# Altium project JWB-001_Main.PrjPcb
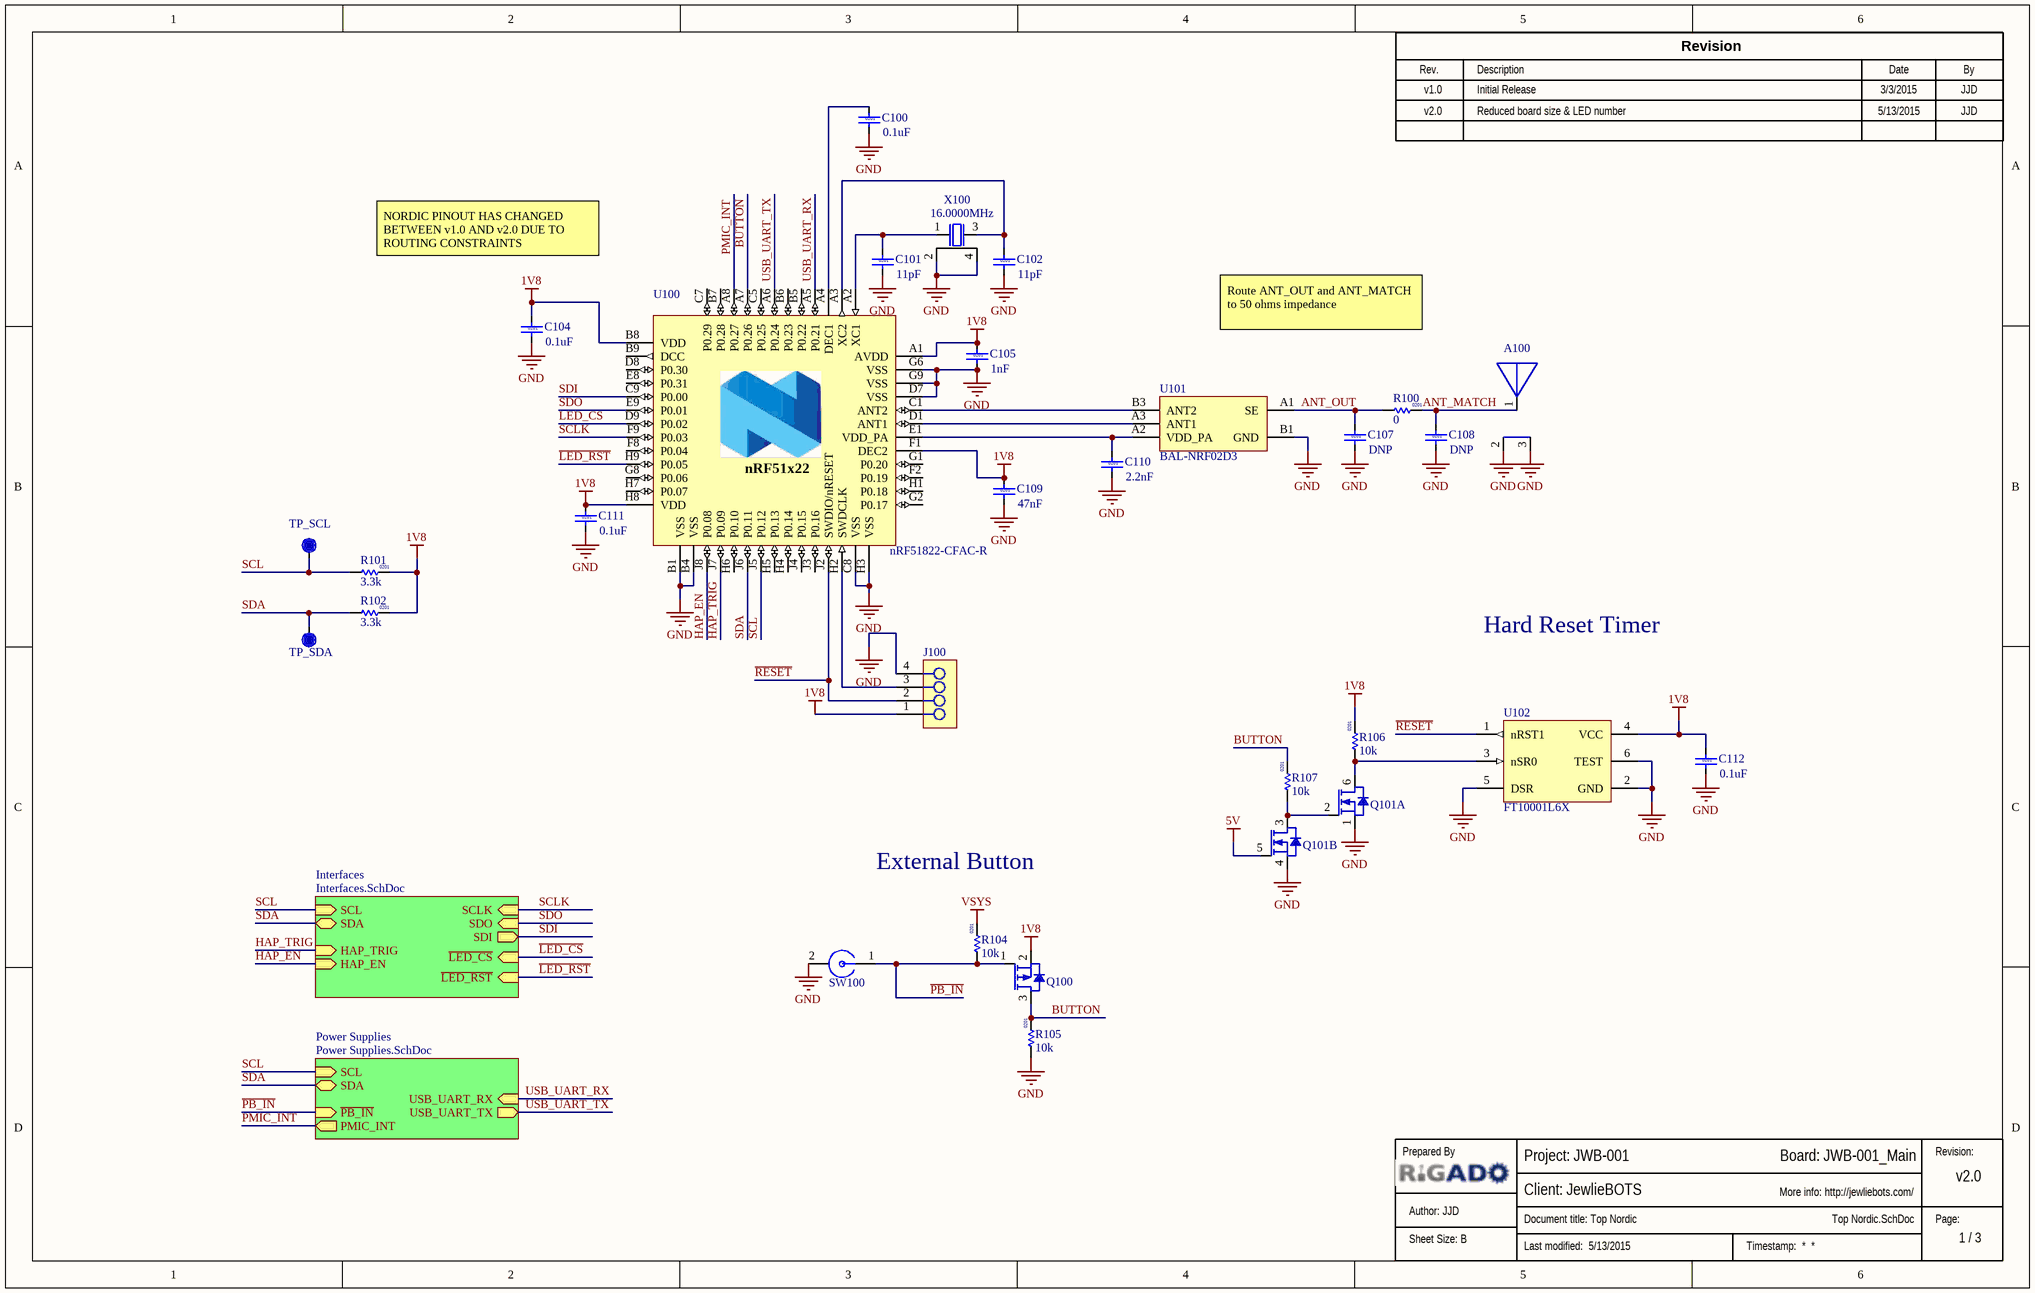
[diagram p0: Top Nordic.SchDoc]
SchSheetTotal: 3; ReleaseRev2: v2.0; ReleaseRev1: v1.0; ReleaseDesc2: Reduced board size & LED number; ReleaseDesc1: Initial Release; ReleaseDate2: 5/13/2015; ReleaseDate1: 3/3/2015; ReleaseBy2: JJD; ReleaseBy1: JJD; ProjectEngineer: JJD; PCBName: JWB-001_Main; GlobalReleaseDate: 5/13/2015; GlobalProjectTeam: Rigado, LLC.; GlobalProjectRevision: v2.0; GlobalProjectName: JWB-001; GlobalProjectLink: http://jewliebots.com/; GlobalClientName: JewlieBOTS
3 sheets, 87 parts. Net scope: hierarchical (ports join the sheet entries above them; power ports are global).
Board file: JWB-001_Main.PcbDoc
Sheets:
  Top Nordic.SchDoc
    Interfaces = Interfaces.SchDoc
    Power Supplies = Power Supplies.SchDoc

## Sheet Top Nordic.SchDoc: Top Nordic
size B; CompanyName: Rigado, LLC; SheetNumber: 1; Website: www.rigado.com; SheetSize: B

### Parts
(Parts that share a designator on the sheet are numbered #1, #2 ... from top to bottom, then left to right.)
?#1  (no value)  (graphical)
?#2  (no value)  (graphical)
A100  2450AT07A0100  [2450AT07A0100]  (value not drawn)
C100  value 0.1uF  Size: 0201  [Cap 0201 HD]  (hidden comment: Cap 0201 0.1uF 6.3V0.1uF)
C101  value 11pF  Size: 0201  [Cap 0201 HD]  (hidden comment: Cap 0201 11pF 25V11pF)
C102  value 11pF  Size: 0201  [Cap 0201 HD]  (hidden comment: Cap 0201 11pF 25V11pF)
C104  value 0.1uF  Size: 0201  [Cap 0201 HD]  (hidden comment: Cap 0201 0.1uF 6.3V0.1uF)
C105  value 1nF  Size: 0201  [Cap 0201 HD]  (hidden comment: Cap 0201 1nF 25V1nF)
C107  value DNP  Size: 0201  [Cap 0201 HD]  (hidden comment: Cap 0201 GenericDNPDNP)
C108  value DNP  Size: 0201  [Cap 0201 HD]  (hidden comment: Cap 0201 GenericDNPDNP)
C109  value 47nF  Size: 0201  [Cap 0201 HD]  (hidden comment: Cap 0201 47nF 10V47nF)
C110  value 2.2nF  Size: 0201  [Cap 0201 HD]  (hidden comment: Cap 0201 2.2nF 16V2.2nF)
C111  value 0.1uF  Size: 0201  [Cap 0201 HD]  (hidden comment: Cap 0201 0.1uF 6.3V0.1uF)
C112  value 0.1uF  Size: 0201  [Cap 0201 HD]  (hidden comment: Cap 0201 0.1uF 6.3V0.1uF)
J100  SWD_Pogo_TPDNP  [TP10R_1.27P-4Pin]  (value not drawn)
Q100  RZM001P02  [SOT-723]  (value not drawn)
Q101  Si1902CDL  [SC70-6]  (value not drawn)  (parts A,B of 2)
R100  value 0  Size: 0201  [RES 0201 HD]  (hidden comment: Res 0201 0R Jumper0)
R101  value 3.3k  Size: 0201  [RES 0201 HD]  (hidden comment: Res 0201 3.3k 5%3.3k)
R102  value 3.3k  Size: 0201  [RES 0201 HD]  (hidden comment: Res 0201 3.3k 5%3.3k)
R104  value 10k  Size: 0201  [RES 0201 HD]  (hidden comment: Res 0201 10k 5%10k)
R105  value 10k  Size: 0201  [RES 0201 HD]  (hidden comment: Res 0201 10k 5%10k)
R106  value 10k  Size: 0201  [RES 0201 HD]  (hidden comment: Res 0201 10k 5%10k)
R107  value 10k  Size: 0201  [RES 0201 HD]  (hidden comment: Res 0201 10k 5%10k)
SW100  GX05170  [GX05170]  (value not drawn)
TP_SCL  TP  [TP10R]  (value not drawn)
TP_SDA  TP  [TP10R]  (value not drawn)
U100  Manufacturer P/N: nRF51822-CFAC-R  [CFAC_WLCSP]
U101  BAL-NRF02D3  [BGA0.4P2x3-5Pin]
U102  FT10001L6X  [DFN0.5P-6Pin]
X100  Frequency: 16.0000MHz  [XTAL_2016]

### Sub-sheets
Interfaces = Interfaces.SchDoc: SDA (bidir), SCL (in), SDO (in), ~{LED_CS} (in), ~{LED_RST} (in), SCLK (in), HAP_EN (in), HAP_TRIG (in), SDI (out)
Power Supplies = Power Supplies.SchDoc: SCL (in), SDA (bidir), PMIC_INT (out), ~{PB_IN} (in), USB_UART_RX (in), USB_UART_TX (out)

### Nets
1V8: C104.1 C105.1 C109.1 C111.1 C112.1 J100.1 Q100.2(S) R101.2 R102.2 R106.2 U100.A1(AVDD) U100.B8(VDD) U100.F1(DEC2) U100.H8(VDD) U102.4(VCC)
5V: Q101.5(G2)
GND: A100.2 A100.3 C100.2 C101.2 C102.2 C104.2 C105.2 C107.2 C108.2 C109.2 C110.2 C111.2 C112.2 J100.4 Q101.1(S1) Q101.4(S2) R105.1 SW100.2 U100.B1(VSS) U100.B4(VSS) U100.C8(VSS) U100.D7(VSS) U100.G3(N.C.) U100.G4(N.C.) U100.G6(VSS) U100.G9(VSS) U100.H3(VSS) U101.B1(GND) U102.2(GND) U102.5(DSR) U102.6(TEST) X100.2 X100.4
VSYS: R104.2
~{LED_CS}: U100.D9(P0.02) ; sheet Interfaces/~{LED_CS}
~{LED_RST}: U100.H9(P0.05) ; sheet Interfaces/~{LED_RST}
~{PB_IN}: Q100.1(G) R104.1 SW100.1 ; sheet Power Supplies/~{PB_IN}
~{RESET}: J100.2 U100.J2(SWDIO/nRESET) U102.1(nRST1)
ANT_MATCH: A100.1 C108.1 R100.2
ANT_OUT: C107.1 R100.1 U101.A1(SE)
BUTTON: Q100.3(D) R105.2 R107.2 U100.A7(P0.26)
HAP_EN: U100.J8(P0.08) ; sheet Interfaces/HAP_EN
HAP_TRIG: U100.J7(P0.09) ; sheet Interfaces/HAP_TRIG
PMIC_INT: U100.A8(P0.27) ; sheet Power Supplies/PMIC_INT
SCL: R101.1 TP_SCL.1 U100.J5(P0.12) ; sheet Interfaces/SCL, sheet Power Supplies/SCL
SCLK: U100.F9(P0.03) ; sheet Interfaces/SCLK
SDA: R102.1 TP_SDA.1 U100.J6(P0.11) ; sheet Interfaces/SDA, sheet Power Supplies/SDA
SDI: U100.C9(P0.00) ; sheet Interfaces/SDI
SDO: U100.E9(P0.01) ; sheet Interfaces/SDO
USB_UART_RX: U100.A5(P0.21) ; sheet Power Supplies/USB_UART_RX
USB_UART_TX: U100.A6(P0.24) ; sheet Power Supplies/USB_UART_TX
NetC100_1: C100.1 U100.A4(DEC1)
NetC101_1: C101.1 U100.A2(XC1) X100.1
NetC102_1: C102.1 U100.A3(XC2) X100.3
NetC110_1: C110.1 U100.E1(VDD_PA) U101.A2(VDD_PA)
NetJ100_3: J100.3 U100.H2(SWDCLK)
NetQ101_2: Q101.2(G1) Q101.3(D2) R107.1
NetQ101_6: Q101.6(D1) R106.1 U102.3(nSR0)
NetU100_C1: U100.C1(ANT2) U101.B3(ANT2)
NetU100_D1: U100.D1(ANT1) U101.A3(ANT1)

Not connected (* = marked no-connect by the designer): U100 B5(P0.22) B6(P0.23) B7(P0.28) B9(DCC) C5(P0.25) C6(N.C.) C7(P0.29) D8(P0.30) E2(N.C.) E3(N.C.) E7(N.C.) E8(P0.31) F2(P0.19) F3(N.C.) F7(N.C.) F8(P0.04) G1(P0.20) G2(P0.17) G5(N.C.) G7(N.C.) G8(P0.06) H1(P0.18) H4(P0.14) H5(P0.13) H6(P0.10) H7(P0.07) J3(P0.16) J4(P0.15)

### Notes on the sheet
- NORDIC PINOUT HAS CHANGED BETWEEN v1.0 AND v2.0 DUE TO ROUTING CONSTRAINTS
- Route ANT_OUT and ANT_MATCH to 50 ohms impedance
- Hard Reset Timer
- External Button
- Rev.
- Description
- Revision
- Date
- By
- Prepared By
- Revision:
- Page:
- (in symbol nRF51822-CFAC) nRF51x22

### Library data of the parts
?#1 = Top_Revision_Block: Release Revision History Block
?#2 = Top_Title_Block: Top level schematic title block for top level sheet
A100 = 2450AT07A0100: Utra-Minature 2.4GHz Chip antenna, 1.0mm x 0.5mm; Manufacturer: Johanson Technology; Vendor: Digikey; Vendor P/N: 712-1572-1-ND; Added By: Jeremy D; Part Number: 2450AT07A0100; Manufacturer P/N: 2450AT07A0100; Size: 1mmx0.5mm; Height: 0.37mm; Internal Antenna: N/A; RF Freq: 2.4GHz; Added Date: 1/31/2015; Checked Date: 2/5/2015; Checked By: Paul B
C100 C104 C111 C112 = Cap 0201 0.1uF 6.3V: Cap, Ceramic 0.1uF 6.3V 10% X5R  0201; Manufacturer P/N: GRM033R60J104KE19D; Manufacturer: Murata; Manufacturer 2 P/N: C0603X5R0J104K030BC; Vendor: Digikey; Vendor P/N: 490-3167-1-ND; Added By: Jeremy D; Part Number: Cap 0201 0.1uF 6.3V; Tolerance: 10%; Voltage: 6.3V; Manufacturer 2: TDK; Height: 0.33mm; Temp Coefficient: X5R; Added Date: 2/1/2015; Checked By: Cam N; Checked Date: 2/27/2015
C101 C102 = Cap 0201 11pF 25V: Cap, Ceramic 11pF 25V 5% NPO  0201; Manufacturer P/N: CL03C110JA3GNNC; Manufacturer: Samsung; Manufacturer 2 P/N: C0603C0G1E110J030BG; Vendor: Digikey; Vendor P/N: 1276-1386-1-ND; Added By: Jeremy D; Part Number: Cap 0201 11pF 25V; Tolerance: 5%; Voltage: 25V; Manufacturer 2: TDK; Temp Coefficient: NPO; Height: 0.33mm; Added Date: 2/24/2015; Checked By: Cam N; Checked Date: 2/27/2015
C105 = Cap 0201 1nF 25V: Cap, Ceramic 1nF 25V 10% X7R  0201; Manufacturer P/N: GRM033R71E102KA01D; Manufacturer: Murata; Manufacturer 2 P/N: C0603X7R1E102K030BA; Vendor: Digikey; Vendor P/N: 490-3184-1-ND; Added By: Jeremy D; Part Number: Cap 0201 1nF 25V; Tolerance: 10%; Voltage: 25V; Manufacturer 2: TDK; Temp Coefficient: X7R; Height: 0.33mm; Added Date: 2/24/2015; Checked By: Cam N; Checked Date: 2/27/2015
C107 C108 = Cap 0201 Generic: Capacitor, Ceramic 0201; Added By: Jeremy D; Part Number: Cap 0201 Generic; Height: 0.33mm; DNP: DNP; Added Date: 2/1/2015; Checked By: Paul B; Checked Date: 2/5/2015
C109 = Cap 0201 47nF 10V: Cap, Ceramic 47nF 10V 10% X5R  0201; Manufacturer P/N: LMK063BJ473KP-F; Manufacturer: Taiyo Yuden; Manufacturer 2 P/N: CL03A473KP3NNNC; Vendor: Digikey; Vendor P/N: 587-2242-1-ND; Added By: Jeremy D; Part Number: Cap 0201 47nF 10V; Tolerance: 10%; Voltage: 10V; Manufacturer 2: Samsung; Temp Coefficient: X5R; Height: 0.33mm; Added Date: 2/24/2015; Checked By: Cam N; Checked Date: 2/27/2015
C110 = Cap 0201 2.2nF 16V: Cap, Ceramic 2.2nF 16V 10% X7R  0201; Manufacturer P/N: GRM033R71C222KA88D; Manufacturer: Murata; Manufacturer 2 P/N: C0603X7R1C222K030BA; Vendor: Digikey; Vendor P/N: 490-3190-1-ND; Added By: Jeremy D; Part Number: Cap 0201 2.2nF 16V; Tolerance: 10%; Voltage: 16V; Manufacturer 2: TDK; Temp Coefficient: X7R; Height: 0.33mm; Added Date: 2/24/2015; Checked By: Cam N; Checked Date: 2/27/2015
J100 = SWD_Pogo_TP: Test points for 4-wire Serial Wire Debugger header Pogo Pin harness; Added By: Jeremy D; Part Number: SWD_Pogo_TP; Size: 4.8mm x 1mm; Height: 0; DNP: DNP; Added Date: 2/23/2015; Checked By: Cam N; Checked Date: 2/27/2015
Q100 = RZM001P02: P-MOSFET, 20V 100mA, SOT-723; Manufacturer P/N: RZM001P02T2L; Manufacturer: Rohm; VGS Threshold: -1.0V; Vendor: Digikey; Vendor P/N: RZM001P02T2LCT-ND; Added By: Jeremy D; Part Number: RZM001P02; Size: 1.2mm x 0.8mm; Package: SOT-723; Height: 0.55mm; Voltage Rated: 20V; Idc: 100mA; Type: P-MOSFET; Added Date: 2/22/2015; Checked By: Cam N; Checked Date: 2/27/2015
Q101 = Si1902CDL: Dual N-MOSFET, 20V 1A, SC70-6; Manufacturer P/N: SI1902CDL-T1-GE3; Manufacturer: Vishay; VGS Threshold: 1.5V; Vendor: Mouser; Vendor P/N: 78-SI1902CDL-T1-GE3; Added By: Jeremy D; Part Number: Si1902CDL; Size: 2.4mm x 2.2mm; Package: SC70-6; Height: 1.1mm; Voltage Rated: 20V; Idc: 1A; Type: N-MOSFET; Added Date: 3/3/2015; Checked By: Cam N; Checked Date: 3/3/2015
R100 = Res 0201 0R Jumper: Resistor 0 ohm  1/20W, 0201; Manufacturer P/N: RC0603J000CS; Manufacturer: Samsung; Manufacturer 2 P/N: ERJ-1GN0R00C; Vendor: Digikey; Vendor P/N: 1276-3742-1-ND; Added By: Jeremy D; Part Number: Res 0201 0R Jumper; Manufacturer 2: Panasonic; Height: 0.26mm; Power: 1/20W; Added Date: 2/24/2015; Checked By: Cam N; Checked Date: 2/27/2015
R101 R102 = Res 0201 3.3k 5%: Resistor 3.3k ohm 5% 1/20W, 0201; Manufacturer P/N: RC0603J332CS; Manufacturer: Samsung; Manufacturer 2 P/N: MCR006YRTJ332; Vendor: Digikey; Vendor P/N: 1276-3806-1-ND; Added By: Jeremy D; Part Number: Res 0201 3.3k 5%; Manufacturer 2: Rohm; Tolerance: 5%; Height: 0.26mm; Power: 1/20W; Added Date: 2/24/2015; Checked By: Cam N; Checked Date: 2/27/2015
R104-R107 = Res 0201 10k 5%: Resistor 10k ohm 5% 1/20W 0201; Manufacturer P/N: MCR006YRTJ103; Manufacturer: Rohm; Manufacturer 2 P/N: ERJ-1GEJ103C; Vendor: Digikey; Vendor P/N: RHM10KCCCT-ND; Added By: Jeremy D; Part Number: Res 0201 10k 5%; Manufacturer 2: Panasonic; Tolerance: 5%; Height: 0.26mm; Power: 1/20W; Added Date: 2/1/2015; Checked By: Paul B; Checked Date: 2/5/2015
SW100 = GX05170: Snap Dome, high activation force, 5.3mm dia; Manufacturer: Snaptron; Num Positions: 1; Circuit Type: MOM; Added By: Jeremy D; Part Number: GX05170; Manufacturer P/N: GX05170; Size: 5.3mm dia; Height: 0.254mm; Vendor: Snaptron; Added Date: 2/18/2015; Checked By: Cam N; Checked Date: 2/27/2015
TP_SCL TP_SDA = TP10R: Testpoint, Round 1.0mm Dia; Added By: Jeremy D; Part Number: TP10R; Size: 1.0mm; Height: 0; Added Date: 2/1/2015; Checked By: Paul B; Checked Date: 2/5/2015; DNP: DNP
U100 = nRF51822-CFAC: Multiporotocol Bluetooth low energy/2.4GHz RF System on Chip; Manufacturer: Nordic Semiconductor; MFG Footprint: WLCSP 3.83mm x 3.83 mm; Pin #: 62; Voltage-Rated: 3.6V; Flash: 256kB; RAM: 32kB; Number of Bits: 32; Vendor: Digikey; Vendor P/N: 1490-1041-1-ND; Added By: Jeremy D; Part Number: nRF51822-CFAC; Height: .55mm; Packaging: Tape & Reel; Features: 2.4 GHz Transceiver, ARM Cortex M0 32 bit, ADC, 31 GPIO, Serial Protocols; Added Date: 1/30/2015; Checked By: Paul B; Checked Date: 2/5/2015
U101 = BAL-NRF02D3: Balun, 50 ohm transformer for nRF51x22; Manufacturer: ST Micro; RF Freq: 2.4GHz; Vendor: Digikey; Vendor P/N: 497-14009-1-ND; Added By: Jeremy D; Manufacturer P/N: BAL-NRF02D3; Part Number: BAL-NRF02D3; Size: 1.435mmx.905mm; Height: 0.69mm; Internal Antenna: N/A; Added Date: 1/30/2015; Checked Date: 2/5/2015; Checked By: Paul B
U102 = FT10001L6X: Reset Timer with 10.0sec Fixed Delay and Reset Pulse, 1.65v-5.0v; Manufacturer: Fairchild; MFG Footprint: 6-UFDFN; Controller Interface: Discrete; Added By: Jeremy D; Manufacturer P/N: FT10001L6X; Part Number: FT10001L6X; Height: .55mm; Size: 1.45mm x 1.0mm; Type: Reset Timer; Features: Fixed 10.0sec delay, 530ms Reset Pulse; Supplier 1: Digi-key; Supplier Part Number 1: FT10001L6XCT-ND; Added Date: 3/30/2015
X100 = FA-128 16.0000M: Crystal, 16.0000MHz, 10ppm, 2.0mm x 1.6mm; Manufacturer: EPSON; Manufacturer P/N: FA-128 16.0000MF10Z -ACX; Tolerance: +/- 10ppm; CL: 9pF; Temp Range: -20C to +75C; Vendor: Arrow; Added By: Jeremy D; Part Number: FA-128 16.0000M; Size: 2.0mm x 1.6mm; Height: 0.5mm; Added Date: 1/31/2015; Checked By: Paul B; Checked Date: 2/5/2015

## Sheet Interfaces.SchDoc
size B; CompanyName: Rigado, LLC; Organization: Rigado, LLC; SheetNumber: 2; SheetSize: B; SheetTitle: LED Driver
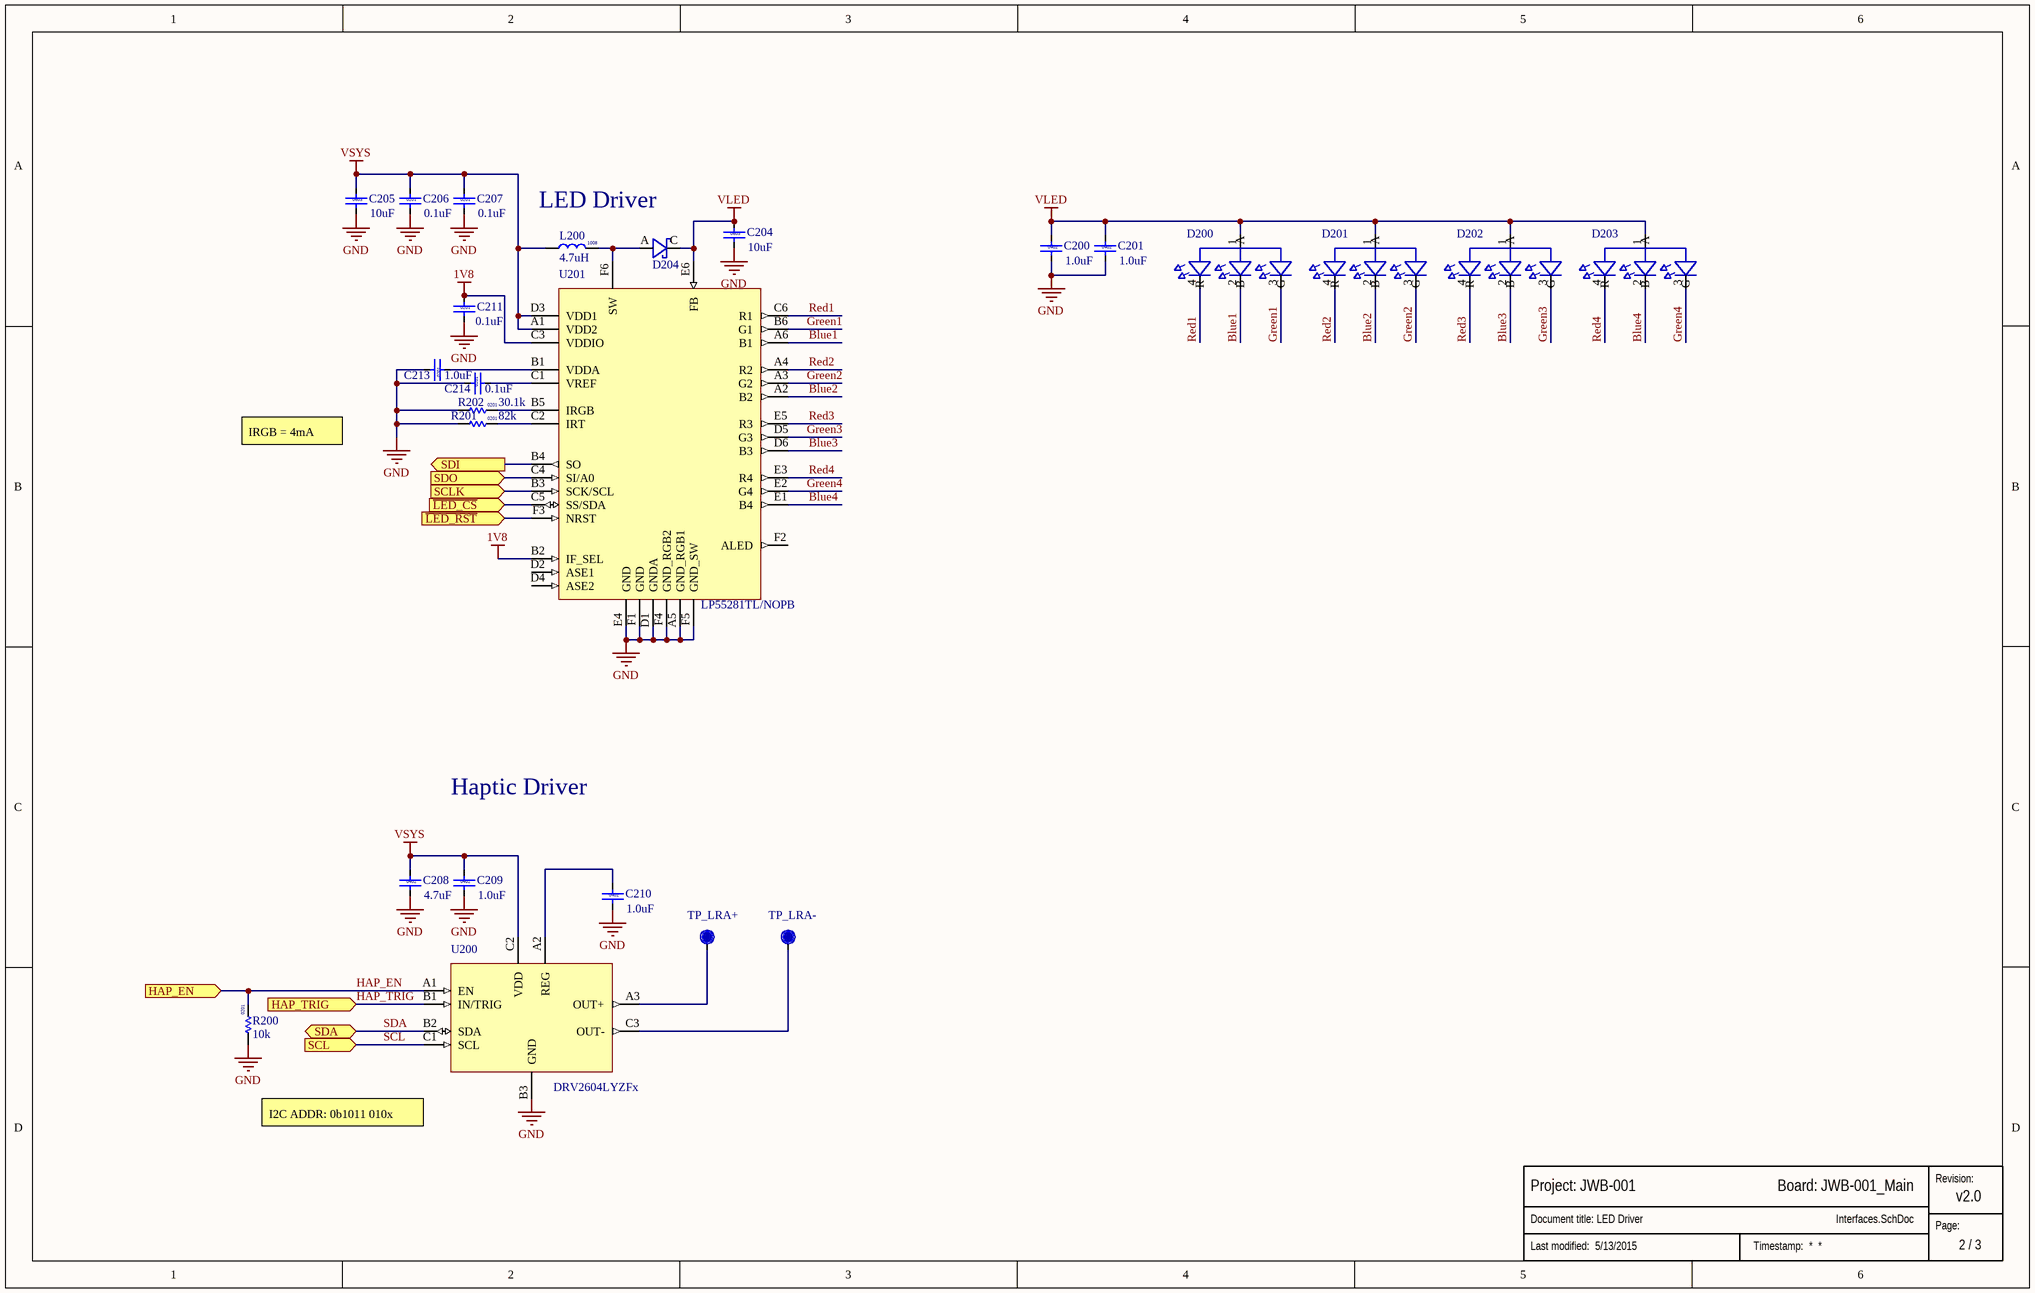
[diagram p1: Interfaces.SchDoc]

### Parts
(Parts that share a designator on the sheet are numbered #1, #2 ... from top to bottom, then left to right.)
?#3  (no value)  (graphical)
C200  value 1.0uF  Size: 0402  [Cap 0402 HD]  (hidden comment: Cap 0402 1.0uF 10V1.0uF)
C201  value 1.0uF  Size: 0402  [Cap 0402 HD]  (hidden comment: Cap 0402 1.0uF 10V1.0uF)
C204  value 10uF  Size: 0603  [Cap 0603]  (hidden comment: Cap 0603 10uF 10V10uF)
C205  value 10uF  Size: 0603  [Cap 0603]  (hidden comment: Cap 0603 10uF 10V10uF)
C206  value 0.1uF  Size: 0201  [Cap 0201 HD]  (hidden comment: Cap 0201 0.1uF 6.3V0.1uF)
C207  value 0.1uF  Size: 0201  [Cap 0201 HD]  (hidden comment: Cap 0201 0.1uF 6.3V0.1uF)
C208  value 4.7uF  Size: 0402  [Cap 0402 HD]  (hidden comment: Cap 0402 4.7uF 10V4.7uF)
C209  value 1.0uF  Size: 0402  [Cap 0402 HD]  (hidden comment: Cap 0402 1.0uF 10V1.0uF)
C210  value 1.0uF  Size: 0402  [Cap 0402 HD]  (hidden comment: Cap 0402 1.0uF 10V1.0uF)
C211  value 0.1uF  Size: 0201  [Cap 0201 HD]  (hidden comment: Cap 0201 0.1uF 6.3V0.1uF)
C213  value 1.0uF  Size: 0201  [Cap 0201 HD]  (hidden comment: Cap 0201 1.0uF 6.3V1.0uF)
C214  value 0.1uF  Size: 0201  [Cap 0201 HD]  (hidden comment: Cap 0201 0.1uF 6.3V0.1uF)
D200  CLMVB-FKA-CFHEHLCBB7A363  [4-PLCC]  (value not drawn)
D201  CLMVB-FKA-CFHEHLCBB7A363  [4-PLCC]  (value not drawn)
D202  CLMVB-FKA-CFHEHLCBB7A363  [4-PLCC]  (value not drawn)
D203  CLMVB-FKA-CFHEHLCBB7A363  [4-PLCC]  (value not drawn)
D204  MBR120VLSFT3G20V  [SOD-123F_U]  (value not drawn)
L200  value 4.7uH  Size: 1008  [IND 1008]  (hidden comment: Ind 1008 4.7uH 650mA4.7uH)
R200  value 10k  Size: 0201  [RES 0201 HD]  (hidden comment: Res 0201 10k 5%10k)
R201  value 82k  Size: 0201  [RES 0201 HD]  (hidden comment: Res 0201 Generic82k)
R202  value 30.1k  Size: 0201  [RES 0201 HD]  (hidden comment: Res 0201 Generic30.1k)
TP_LRA+  TP  [TP17R]  (value not drawn)
TP_LRA-  TP  [TP17R]  (value not drawn)
U200  Manufacturer P/N: DRV2604LYZFx  [BGA0.5P3x3-9Pin]  (hidden comment: DRV2604L)
U201  Manufacturer P/N: LP55281TL/NOPB  [BGA0.5P6x6-36Pin]  (hidden comment: LP55281TL)

### Ports
HAP_EN (in), HAP_TRIG (in), SCL (in), SCLK (in), SDA (bidir), SDI (out), SDO (in), ~{LED_CS} (in), ~{LED_RST} (in)

### Nets
1V8: C211.1 U201.B2(IF_SEL) U201.C3(VDDIO)
GND: C200.2 C201.2 C204.2 C205.2 C206.2 C207.2 C208.2 C209.2 C210.2 C211.2 C213.2 C214.1 R200.1 R201.1 R202.1 U200.B3(GND) U201.A5(GND_RGB1) U201.D1(GNDA) U201.E4(GND) U201.F1(GND) U201.F4(GND_RGB2) U201.F5(GND_SW)
VLED: C200.1 C201.1 C204.1 D200.1(A) D201.1(A) D202.1(A) D203.1(A) D204.C U201.E6(FB)
VSYS: C205.1 C206.1 C207.1 C208.1 C209.1 L200.1 U200.C2(VDD) U201.A1(VDD2) U201.D3(VDD1)
~{LED_CS}: U201.C5(SS/SDA) ; port ~{LED_CS}
~{LED_RST}: U201.F3(NRST) ; port ~{LED_RST}
Blue1: D200.2(B) U201.A6(B1)
Blue2: D201.2(B) U201.A2(B2)
Blue3: D202.2(B) U201.D6(B3)
Blue4: D203.2(B) U201.E1(B4)
Green1: D200.3(G) U201.B6(G1)
Green2: D201.3(G) U201.A3(G2)
Green3: D202.3(G) U201.D5(G3)
Green4: D203.3(G) U201.E2(G4)
HAP_EN: R200.2 U200.A1(EN) ; port HAP_EN
HAP_TRIG: U200.B1(IN/TRIG) ; port HAP_TRIG
Red1: D200.4(R) U201.C6(R1)
Red2: D201.4(R) U201.A4(R2)
Red3: D202.4(R) U201.E5(R3)
Red4: D203.4(R) U201.E3(R4)
SCL: U200.C1(SCL) ; port SCL
SCLK: U201.B3(SCK/SCL) ; port SCLK
SDA: U200.B2(SDA) ; port SDA
SDI: U201.B4(SO) ; port SDI
SDO: U201.C4(SI/A0) ; port SDO
NetC210_1: C210.1 U200.A2(REG)
NetC213_1: C213.1 U201.B1(VDDA)
NetC214_2: C214.2 U201.C1(VREF)
NetD204_A: D204.A L200.2 U201.F6(SW)
NetR201_2: R201.2 U201.C2(IRT)
NetR202_2: R202.2 U201.B5(IRGB)
NetTP_LRA+_1: TP_LRA+.1 U200.A3(OUT+)
NetTP_LRA-_1: TP_LRA-.1 U200.C3(OUT-)

Not connected (* = marked no-connect by the designer): U201 D2(ASE1) D4(ASE2) F2(ALED)

### Notes on the sheet
- LED Driver
- IRGB = 4mA
- Haptic Driver
- (near U200) I2C ADDR: 0b1011 010x
- Revision:
- Page:

### Library data of the parts
?#3 = Sub_Title_Block: Minimized schematic title block for all subset sheets
C200 C201 C209 C210 = Cap 0402 1.0uF 10V: Cap, Ceramic 1.0uF 10V 10% X5R 0402; Manufacturer P/N: GRM155R61A105KE15D; Manufacturer: Murata; Manufacturer 2 P/N: C1005X5R0J105K050BB; Vendor: Digikey; Vendor P/N: 490-3890-1-ND; Added By: Jeremy D; Part Number: Cap 0402 1.0uF 10V; Tolerance: 10%; Voltage: 10V; Manufacturer 2: TDK; Height: 0.55mm; Temp Coefficient: X5R; Added Date: 2/1/2015; Checked By: Paul B; Checked Date: 2/5/2015
C204 C205 = Cap 0603 10uF 10V: Cap, Ceramimic 10uF 10V 20% X5R 0603; Manufacturer P/N: C1608X5R1A106M080AC; Manufacturer: TDK; Manufacturer 2 P/N: LMK107BBJ106MAHT; Vendor: Digikey; Vendor P/N: 445-6853-1-ND; Added By: Jeremy D; Part Number: Cap 0603 10uF 10V; Tolerance: 20%; Voltage: 10V; Manufacturer 2: Taiyo Yuden; Temp Coefficient: X5R; Height: 0.9mm; Added Date: 12/12/2014; Checked By: Cam N; Checked Date: 2/27/2015
C206 C207 C211 C214 = Cap 0201 0.1uF 6.3V: as C100 on sheet Top Nordic; Part Number: Cap 0201 0.1uF 6.3V; Tolerance: 10%; Voltage: 6.3V; Manufacturer 2: TDK; Temp Coefficient: X5R; Height: 0.33mm; Added Date: 2/1/2015; Checked By: Cam N; Checked Date: 2/27/2015
C208 = Cap 0402 4.7uF 10V: Cap, Ceramic 4.7uF 10V 20% X5R 0402; Manufacturer P/N: CL05A475MP5NRNC; Manufacturer: Samsung; Manufacturer 2 P/N: C1005X5R1A475M050BC; Vendor: Digikey; Vendor P/N: 1276-1482-1-ND; Added By: Jeremy D; Part Number: Cap 0402 4.7uF 10V; Tolerance: 20%; Voltage: 10V; Manufacturer 2: TDK; Height: 0.55m; Temp Coefficient: X5R; Added Date: 2/1/2015; Checked By: Paul B; Checked Date: 2/5/2015
C213 = Cap 0201 1.0uF 6.3V: Cap, Ceramic 1.0uF 6.3V 20% X5R  0201; Manufacturer P/N: CL03A105MQ3CSNC; Manufacturer: Samsung; Manufacturer 2 P/N: C0603X5R0J105M030BC; Vendor: Digi-key; Vendor P/N: 1276-1325-1-ND; Added By: Jeremy D; Part Number: Cap 0201 1.0uF 6.3V; Tolerance: 20%; Voltage: 6.3V; Manufacturer 2: TDK; Temp Coefficient: X5R; Height: 0.33mm; Added Date: 2/24/2015; Checked By: Cam N; Checked Date: 2/27/2015
D200-D203 = CLMVB-FKA-CFHEHLCBB7A363: RGB LED SMD, Diffused; Manufacturer: Cree; Voltage Rated: 2.6V, 3.8V, 3.8V; Idc: 20mA, 10mA, 10mA; Added By: Jeremy D; Part Number: CLMVB-FKA-CFHEHLCBB7A363; Manufacturer P/N: CLMVB-FKA-CFHEHLCBB7A363; Size: 2.1mm x 2.1mm; Package: 4-PLCC; Height: 1mm; Type: LED; Color: RGB; Supplier 1: Mouser; Supplier Part Number 1: 941-CLMVBFKACFHEHLCB; Added Date: 2/20/2015; Checked By: Cam N; Checked Date: 2/27/2015
D204 = MBR120VLSFT3G: Diode, Schottky, 20V 1A SOD-123F, 340mV Vf @ 1A; Manufacturer: ON Semi; Manufacturer 2 P/N: PMEG2010ER,115; Added By: Jeremy D; Part Number: MBR120VLSFT3G; Manufacturer P/N: MBR120VLSFT3G; Manufacturer 2: NXP; Size: 3.8mm x 1.8mm; Package: SOD-123F; Height: 1.1mm; Voltage Rated: 20V; Idc: 1A; Type: Schottky; Color: N/A; Supplier 1: Digi-key; Supplier Part Number 1: MBR120VLSFT3GOSCT-ND; Added Date: 3/24/2015
L200 = Ind 1008 4.7uH 650mA: Inductor, 4.7uH, 1008; Manufacturer P/N: CIG22B4R7MNE; Manufacturer: Samsung; Manufacturer 2 P/N: CIG22H4R7MNE; Tolerance: 20%; Vendor: Digikey; Vendor P/N: 1276-6218-1-ND; Isat: 650mA; Added By: Jeremy D; Part Number: Ind 1008 4.7uH 650mA; Manufacturer 2: Samsung; Height: 1mm; Added Date: 2/20/2015; Checked By: Cam N; Checked Date: 2/27/2015
R200 = Res 0201 10k 5%: Resistor 10k ohm 5% 1/20W 0201; Manufacturer: Rohm; Manufacturer P/N: MCR006YRTJ103; Manufacturer 2 P/N: ERJ-1GEJ103C; Vendor: Digikey; Vendor P/N: RHM10KCCCT-ND; Added By: Jeremy D; Part Number: Res 0201 10k 5%; Manufacturer 2: Panasonic; Tolerance: 5%; Height: 0.26mm; Power: 1/20W; Added Date: 2/1/2015; Checked By: Paul B; Checked Date: 2/5/2015
R201 R202 = Res 0201 Generic: Resistor, 0201; Added By: Jeremy D; Part Number: Res 0201 Generic; Height: 0.26mm; Added Date: 12/12/2014; Checked By: Paul B; Checked Date: 2/5/2015
TP_LRA+ TP_LRA- = TP17R: Testpoint, Round 1.7mm Dia; Added By: Jeremy D; Part Number: TP17R; Size: 1.7mm; Height: 0; DNP: DNP; Added Date: 2/1/2015; Checked By: Paul B; Checked Date: 2/5/2015
U200 = DRV2604L: Haptic Driver w/Internal Memory, I2C, DSBGA 9; Manufacturer: Texas Instruments; MFG Footprint: DSBGA 9 (YZF); Voltage-Rated: 5.2V; Vendor: Arrow; Added By: Jeremy D; Part Number: DRV2604L; Height: .625mm; Size: 1.47mm x 1.47mm; Packaging: Tape & Reel; Features: LRA and ERM Haptic Driver w/Memory and Trigger input; Controller Interface: I2C; Added Date: 1/30/2015; Checked By: Paul B; Checked Date: 2/5/2015
U201 = LP55281TL: Quad RGB LED driver w/integrated boost supply and audio sync; Manufacturer: Texas Instruments; MFG Footprint: YZR0036; Voltage-Rated: 5.5V; Controller Interface: SPI/I2C; Added By: Jeremy D; Part Number: LP55281TL; Height: 0.68mm; Size: 3.013mm x 3.013mm; Features: Integrated LED boost, Audio sync; Supplier 1: Digi-key; Supplier Part Number 1: LP55281TL/NOPBCT-ND; Added Date: 3/24/2015; Checked By: Paul B; Checked Date: 5/12/2015

## Sheet Power Supplies.SchDoc
size B; CompanyName: Rigado, LLC; Organization: Rigado, LLC; SheetNumber: 3; SheetSize: B; SheetTitle: LED Driver
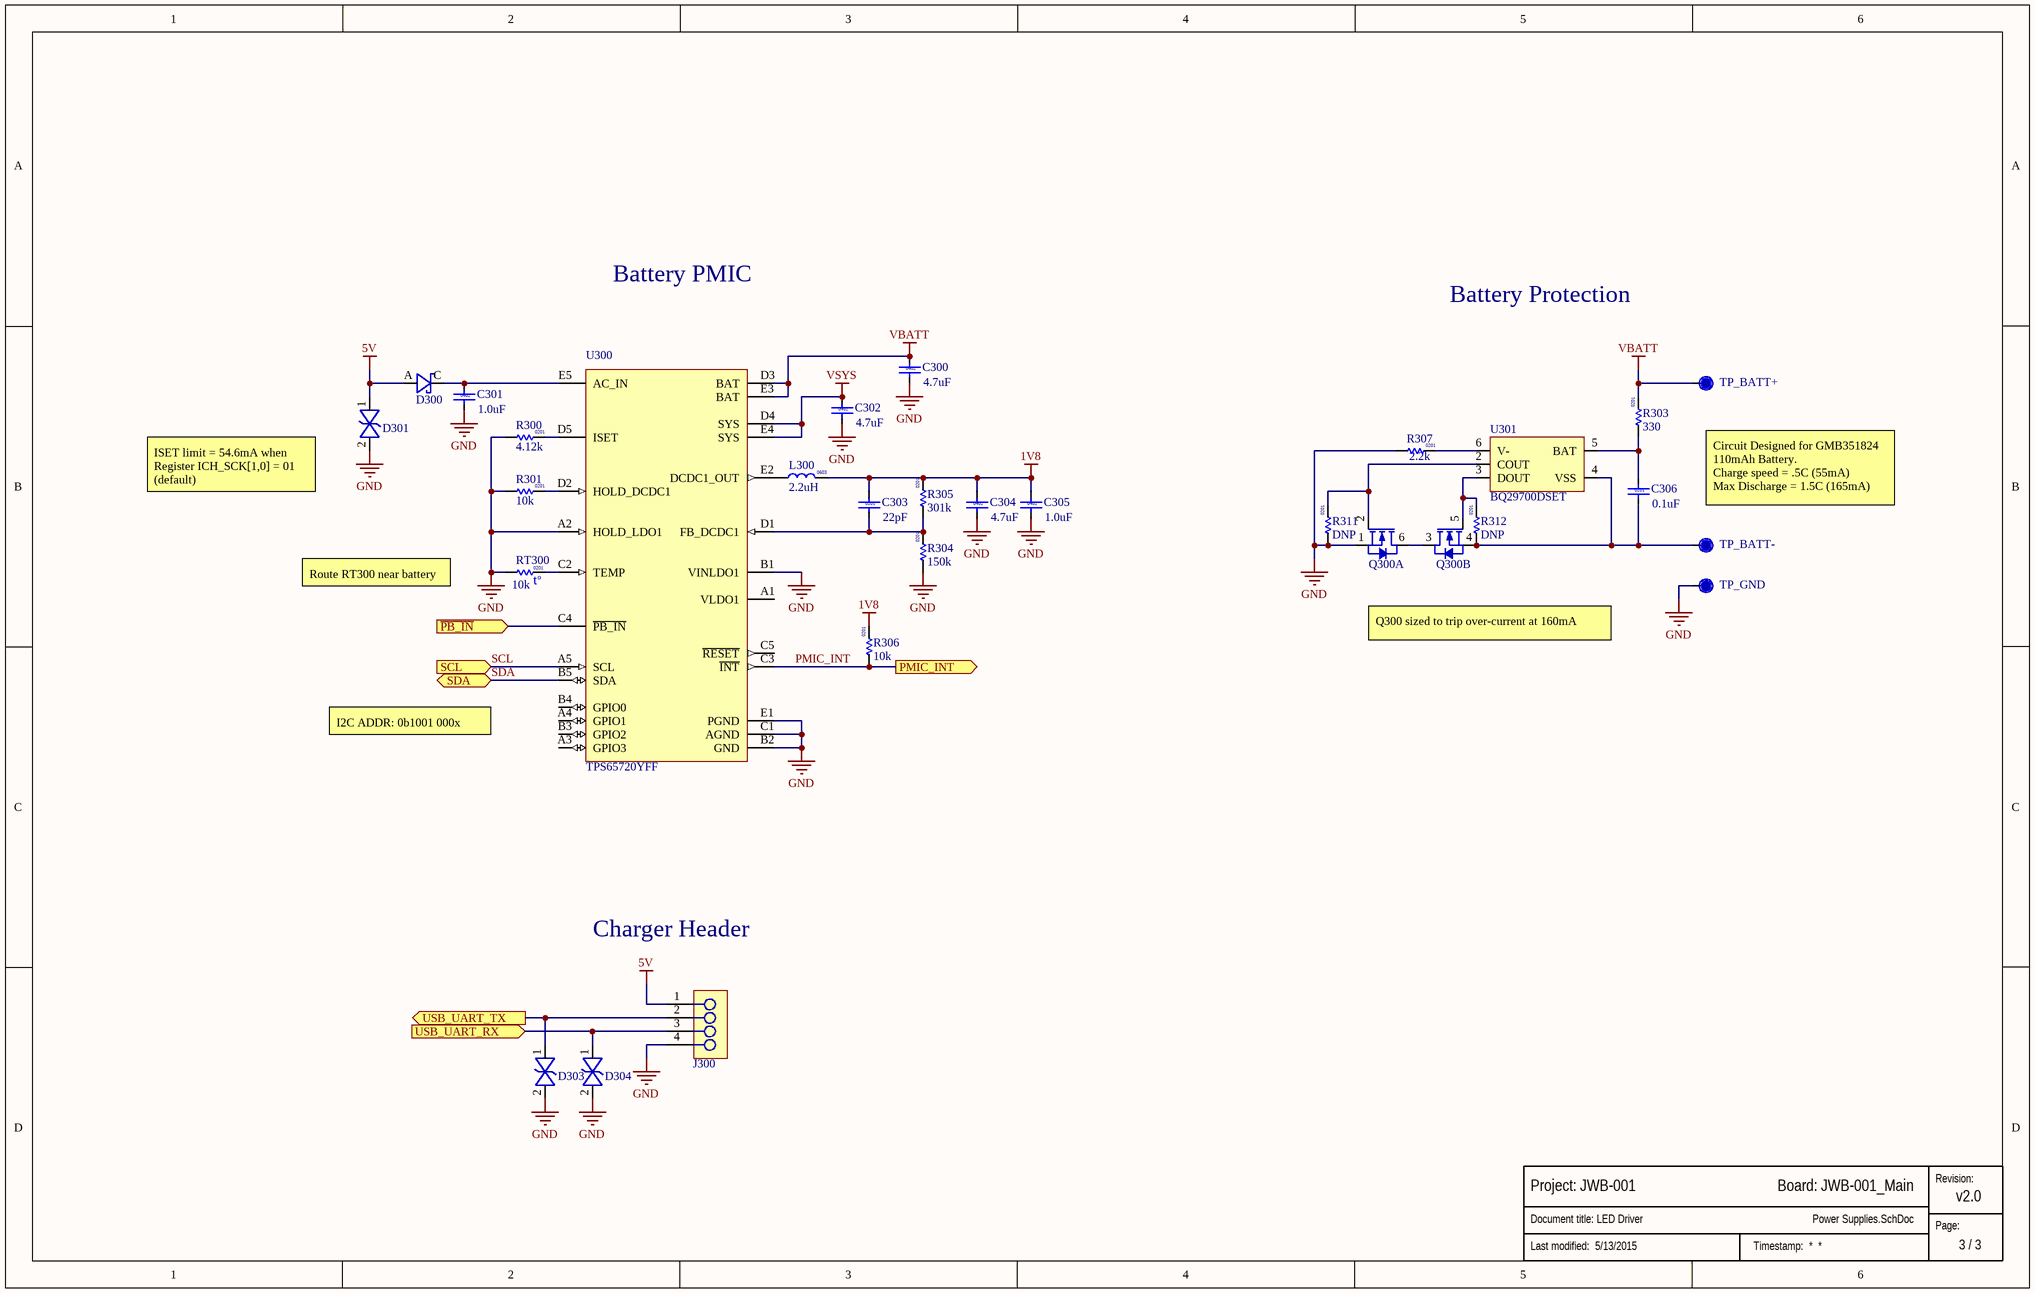
[diagram p2: Power Supplies.SchDoc]

### Parts
(Parts that share a designator on the sheet are numbered #1, #2 ... from top to bottom, then left to right.)
?#4  (no value)  (graphical)
C300  value 4.7uF  Size: 0402  [Cap 0402 HD]  (hidden comment: Cap 0402 4.7uF 10V4.7uF)
C301  value 1.0uF  Size: 0402  [Cap 0402 HD]  (hidden comment: Cap 0402 1.0uF 10V1.0uF)
C302  value 4.7uF  Size: 0402  [Cap 0402 HD]  (hidden comment: Cap 0402 4.7uF 10V4.7uF)
C303  value 22pF  Size: 0201  [Cap 0201 HD]  (hidden comment: Cap 0201 22pF 50V22pF)
C304  value 4.7uF  Size: 0402  [Cap 0402 HD]  (hidden comment: Cap 0402 4.7uF 10V4.7uF)
C305  value 1.0uF  Size: 0402  [Cap 0402 HD]  (hidden comment: Cap 0402 1.0uF 10V1.0uF)
C306  value 0.1uF  Size: 0201  [Cap 0201 HD]  (hidden comment: Cap 0201 0.1uF 6.3V0.1uF)
D300  CDBU05x020V  [Diode 0603 HD]  (value not drawn)
D301  SESD0402P1BN-0450-0906V  [CAP 0402 HD]  (value not drawn)
D303  SESD0402P1BN-0450-0906V  [CAP 0402 HD]  (value not drawn)
D304  SESD0402P1BN-0450-0906V  [CAP 0402 HD]  (value not drawn)
J300  854-22-004-30-001101  [HDR.050P-4Pin-SMT-R]  (value not drawn)
L300  value 2.2uH  Size: 0603  [IND 0603]  (hidden comment: Ind 0603 2.2uH 160mA2.2uH)
Q300  Si1902CDL  [SC70-6]  (value not drawn)  (parts A,B of 2)
R300  value 4.12k  Size: 0201  [RES 0201 HD]  (hidden comment: Res 0201 Generic4.12k)
R301  value 10k  Size: 0201  [RES 0201 HD]  (hidden comment: Res 0201 10k 5%10k)
R303  value 330  Size: 0201  [RES 0201 HD]  (hidden comment: Res 0201 330R 5%330)
R304  value 150k  Size: 0201  [RES 0201 HD]  (hidden comment: Res 0201 150k 1%150k)
R305  value 301k  Size: 0201  [RES 0201 HD]  (hidden comment: Res 0201 301k 1%301k)
R306  value 10k  Size: 0201  [RES 0201 HD]  (hidden comment: Res 0201 10k 5%10k)
R307  value 2.2k  Size: 0201  [RES 0201 HD]  (hidden comment: Res 0201 2.2k 5%2.2k)
R311  value DNP  Size: 0201  [RES 0201 HD]  (hidden comment: Res 0201 GenericDNPDNP)
R312  value DNP  Size: 0201  [RES 0201 HD]  (hidden comment: Res 0201 GenericDNPDNP)
RT300  value 10k  Size: 0201  [RES 0201 HD]  (hidden comment: Res Thermal)
TP_BATT+  TP  [TP17R]  (value not drawn)
TP_BATT-  TP  [TP17R]  (value not drawn)
TP_GND  TP  [TP17R]  (value not drawn)
U300  Manufacturer P/N: TPS65720YFF  [BGA0.4P5x5-25Pin]  (hidden comment: TPS65720)
U301  Manufacturer P/N: BQ29700DSET  [SON0.5P-6Pin]  (hidden comment: BQ29700)

### Ports
PMIC_INT (out), SCL (in), SDA (bidir), USB_UART_RX (in), USB_UART_TX (out), ~{PB_IN} (in)

### Nets
1V8: C303.1 C304.1 C305.1 L300.2 R305.2 R306.2
5V: D300.A D301.1 J300.1
GND: C300.2 C301.2 C302.2 C304.2 C305.2 D301.2 D303.2 D304.2 J300.4 Q300.1(S1) R300.1 R301.1 R304.1 R307.1 R311.1 RT300.2 TP_GND.1 U300.A2(HOLD_LDO1) U300.B1(VINLDO1) U300.B2(GND) U300.C1(AGND) U300.E1(PGND)
VBATT: C300.1 R303.2 TP_BATT+.1 U300.D3(BAT) U300.E3(BAT)
VSYS: C302.1 U300.D4(SYS) U300.E4(SYS)
~{PB_IN}: U300.C4(~{PB_IN}) ; port ~{PB_IN}
PMIC_INT: R306.1 U300.C3(~{INT}) ; port PMIC_INT
SCL: U300.A5(SCL) ; port SCL
SDA: U300.B5(SDA) ; port SDA
USB_UART_RX: D304.1 J300.3 ; port USB_UART_RX
USB_UART_TX: D303.1 J300.2 ; port USB_UART_TX
NetC301_1: C301.1 D300.C U300.E5(AC_IN)
NetC303_2: C303.2 R304.2 R305.1 U300.D1(FB_DCDC1)
NetC306_1: C306.1 R303.1 U301.5(BAT)
NetC306_2: C306.2 Q300.4(S2) R312.1 TP_BATT-.1 U301.4(VSS)
NetL300_1: L300.1 U300.E2(DCDC1_OUT)
NetQ300_2: Q300.2(G1) R311.2 U301.2(COUT)
NetQ300_3: Q300.3(D2) Q300.6(D1)
NetQ300_5: Q300.5(G2) R312.2 U301.3(DOUT)
NetR300_2: R300.2 U300.D5(ISET)
NetR301_2: R301.2 U300.D2(HOLD_DCDC1)
NetR307_2: R307.2 U301.6(V-)
NetRT300_1: RT300.1 U300.C2(TEMP)

Not connected (* = marked no-connect by the designer): U300 A1(VLDO1) A3(GPIO3) A4(GPIO1) B3(GPIO2) B4(GPIO0) C5(~{RESET}); U301 1(NC)

### Notes on the sheet
- Battery PMIC
- Battery Protection
- ISET limit = 54.6mA when
  Register ICH_SCK[1,0] = 01
  (default)
- Circuit Designed for GMB351824
  110mAh Battery.
  Charge speed = .5C (55mA)
  Max Discharge = 1.5C (165mA)
- Route RT300 near battery
- Q300 sized to trip over-current at 160mA
- I2C ADDR: 0b1001 000x
- Charger Header
- Revision:
- Page:
- (in symbol Therm 0201 10k NTC) t°

### Library data of the parts
?#4 = Sub_Title_Block: as ?#3 on sheet Interfaces
C300 C302 C304 = Cap 0402 4.7uF 10V: as C208 on sheet Interfaces; Part Number: Cap 0402 4.7uF 10V; Tolerance: 20%; Voltage: 10V; Manufacturer 2: TDK; Height: 0.55m; Temp Coefficient: X5R; Added Date: 2/1/2015; Checked By: Paul B; Checked Date: 2/5/2015
C301 C305 = Cap 0402 1.0uF 10V: as C200 on sheet Interfaces; Part Number: Cap 0402 1.0uF 10V; Tolerance: 10%; Voltage: 10V; Manufacturer 2: TDK; Height: 0.55mm; Temp Coefficient: X5R; Added Date: 2/1/2015; Checked By: Paul B; Checked Date: 2/5/2015
C303 = Cap 0201 22pF 50V: Cap, Ceramic 22pF 50V 5% NPO  0201; Manufacturer P/N: GRM0335C1H220JA01D; Manufacturer: Murata; Manufacturer 2 P/N: UMK063CG220JT-F; Vendor: Digikey; Vendor P/N: 490-6123-1-ND; Added By: Jeremy D; Part Number: Cap 0201 22pF 50V; Tolerance: 5%; Voltage: 50V; Manufacturer 2: Taiyo Yuden; Temp Coefficient: NPO; Height: 0.33mm; Added Date: 2/24/2015; Checked By: Cam N; Checked Date: 2/27/2015
C306 = Cap 0201 0.1uF 6.3V: as C100 on sheet Top Nordic; Part Number: Cap 0201 0.1uF 6.3V; Tolerance: 10%; Voltage: 6.3V; Manufacturer 2: TDK; Temp Coefficient: X5R; Height: 0.33mm; Added Date: 2/1/2015; Checked By: Cam N; Checked Date: 2/27/2015
D300 = CDBU05x0: Diode, Schottky, 20V 500mA, 470mV Vf @ 500mA, 0603; Manufacturer: Comchip Technology; Manufacturer P/N: CDBU0520; Manufacturer 2 P/N: CDBU0530; Added By: Jeremy D; Part Number: CDBU05x0; Manufacturer 2: Compchip Technology; Size: 1.8mm x 1.0mm; Package: 0603; Height: .85mm; Voltage Rated: 20V; Idc: 500mA; Type: Schottky; Color: N/A; Supplier 1: Digi-key; Supplier Part Number 1: 641-1332-1-ND; Added Date: 5/8/2015
D301 D303 D304 = SESD0402P1BN-0450-090: ESD TVS Diode, 16kV air, 0402; Manufacturer: TE Connectivity; Voltage Rated: 6V; Vendor: Digikey; Vendor P/N: SESD0402P1BN-0450-090CT-ND; Added By: Jeremy D; Part Number: SESD0402P1BN-0450-090; Manufacturer P/N: SESD0402P1BN-0450-090; Size: 1.1mm x 0.5mm; Package: 0402; Height: 0.6mm; Type: TVS; Added Date: 2/1/2015; Checked By: Paul B; Checked Date: 2/5/2015
J300 = 854-22-004-30-001101: Spring Loaded Header 0.05" Pitch, 4Pin, 4x1, 4.98mm - 6.4mm Height; Manufacturer: Mill-Max; Contacts: 4; Rows: 1; Locking: No; Vendor: Mouser; Vendor P/N: 575-854-22-004-30; Added By: Jeremy D; Part Number: 854-22-004-30-001101; Manufacturer P/N: 854-22-004-30-001101; Size: 5.47mm x 2.21mm; Height: 6.4mm; Pin Pitch: 0.05"; Keyed: No; Added Date: 2/23/2015; Checked By: Cam N; Checked Date: 2/27/2015
L300 = Ind 0603 2.2uH 160mA: Inductor, 2.2uH 160mA, 0603; Manufacturer P/N: GLFR1608T2R2M-LR; Manufacturer: TDK; Manufacturer 2 P/N: CBMF1608T2R2M; Tolerance: 20%; Vendor: Digikey; Vendor P/N: 445-3606-1-ND; Added By: Jeremy D; Part Number: Ind 0603 2.2uH 160mA; Manufacturer 2: Taiyo Yuden; Height: 1mm; Isat: 160mA; Added Date: 2/24/2015; Checked By: Cam N; Checked Date: 2/27/2015
Q300 = Si1902CDL: as Q101 on sheet Top Nordic; Part Number: Si1902CDL; Size: 2.4mm x 2.2mm; Package: SC70-6; Height: 1.1mm; Voltage Rated: 20V; Idc: 1A; Type: N-MOSFET; Added Date: 3/3/2015; Checked By: Cam N; Checked Date: 3/3/2015
R300 = Res 0201 Generic: RES SMD 4.12K OHM 1% 1/20W 0201; Manufacturer: Panasonic; Manufacturer P/N: ERJ-1GEF4121C; Vendor: Digikey; Vendor P/N: P4.12KABCT-ND; Added By: Jeremy D; Part Number: Res 0201 Generic; Tolerance: 1%; Height: 0.26mm; Added Date: 12/12/2014; Checked By: Paul B; Checked Date: 2/5/2015
R301 R306 = Res 0201 10k 5%: as R200 on sheet Interfaces; Part Number: Res 0201 10k 5%; Manufacturer 2: Panasonic; Tolerance: 5%; Height: 0.26mm; Power: 1/20W; Added Date: 2/1/2015; Checked By: Paul B; Checked Date: 2/5/2015
R303 = Res 0201 330R 5%: Resistor 330 ohm 5% 1/20W, 0201; Manufacturer P/N: MCR006YRTJ331; Manufacturer: Rohm; Manufacturer 2 P/N: ERJ-1GEJ331C; Vendor: Digikey; Vendor P/N: RHM330CCCT-ND; Added By: Jeremy D; Part Number: Res 0201 330R 5%; Manufacturer 2: Panasonic; Tolerance: 5%; Height: 0.26mm; Power: 1/20W; Added Date: 2/24/2015; Checked By: Cam N; Checked Date: 2/27/2015
R304 = Res 0201 150k 1%: Resistor 150k ohm  1% 1/20W, 0201; Manufacturer P/N: MCR006YRTF1503; Manufacturer: Rohm; Manufacturer 2 P/N: RC0603F154CS; Vendor: Digikey; Vendor P/N: RHM150KCBCT-ND; Added By: Jeremy D; Part Number: Res 0201 150k 1%; Manufacturer 2: Samsung; Tolerance: 1%; Height: 0.26mm; Power: 1/20W; Added Date: 2/24/2015; Checked By: Cam N; Checked Date: 2/27/2015
R305 = Res 0201 301k 1%: Resistor 301k ohm 1% 1/20W, 0201; Manufacturer P/N: ERJ-1GEF3013C; Manufacturer: Panasonic; Manufacturer 2 P/N: RC0603F3013CS; Vendor: Digikey; Vendor P/N: P301KABCT-ND; Added By: Jeremy D; Part Number: Res 0201 301k 1%; Manufacturer 2: Samsung; Tolerance: 1%; Height: 0.26mm; Power: 1/20W; Added Date: 3/30/2015
R307 = Res 0201 2.2k 5%: Resistor 2.2k ohm 5% 1/20W, 0201; Manufacturer P/N: ERJ-1GEJ222C; Manufacturer: Panasonic; Manufacturer 2 P/N: MCR006YRTJ222; Vendor: Digikey; Vendor P/N: P2.2KAGCT-ND; Added By: Jeremy D; Part Number: Res 0201 2.2k 5%; Manufacturer 2: Rohm; Tolerance: 5%; Height: 0.26mm; Power: 1/20W; Added Date: 2/24/2015; Checked By: Cam N; Checked Date: 2/27/2015
R311 R312 = Res 0201 Generic: Resistor, 0201; Added By: Jeremy D; Part Number: Res 0201 Generic; DNP: DNP; Height: 0.26mm; Added Date: 12/12/2014; Checked By: Paul B; Checked Date: 2/5/2015
RT300 = Therm 0201 10k NTC: Thermistor 10k ohm NTC 5% 0201; Manufacturer P/N: NCP03XH103J05RL; Manufacturer: Murata; Vendor: Digikey; Vendor P/N: 490-4644-1-ND; Power: 1/20W; Added By: Jeremy D; Part Number: Therm 0201 10k NTC; Tolerance: 5%; Height: 0.26mm; Added Date: 2/24/2015; Checked By: Cam N; Checked Date: 2/27/2015
TP_BATT+ TP_BATT- TP_GND = TP17R: as TP_LRA+ on sheet Interfaces; Part Number: TP17R; Size: 1.7mm; Height: 0; Added Date: 2/1/2015; Checked By: Paul B; Checked Date: 2/5/2015; DNP: DNP
U300 = TPS65720: PMU for Li-ion batteries, 1xDCDC 1xLDO, .4mm pitch XBGA 2mm x 2mm; Manufacturer: Texas Instruments; MFG Footprint: S-XBGA-N25; Regulator Type: 1x Buck, 1x LDO; Voltage-Rated: 28V; Max Current: 500mA; Added By: Jeremy D; Part Number: TPS65720; Size: 2.12mm x 2.12mm; Height: 0.625mm; Features: Battery management & charging; Supplier 1: Digi-key; Supplier Part Number 1: 296-32530-1-ND; Added Date: 1/30/2015
U301 = BQ29700: Li-Ion single cell voltage and current protection IC; Manufacturer: Texas Instruments; MFG Footprint: DSE (S-PWSON-N6); Voltage-Rated: 12V; 1k Price: 0.46; Vendor: Digikey; Vendor P/N: 296-37746-1-ND; Added By: Jeremy D; Part Number: BQ29700; Size: 1.55mm x 1.55mm; Height: .8mm; Packaging: Tape & Reel; Regulator Type: N/A; Features: Over and under voltage, over current detection; Max Current: N/A; Added Date: 2/19/2015; Checked By: Cam N; Checked Date: 2/27/2015

## Nets that join several sheets
1V8: Top Nordic (15 pins), Interfaces (C211.1 U201.B2 U201.C3), Power Supplies (6 pins)
5V: Top Nordic (Q101.5), Power Supplies (D300.A D301.1 J300.1)
GND: Top Nordic (33 pins), Interfaces (22 pins), Power Supplies (22 pins)
VSYS: Top Nordic (R104.2), Interfaces (9 pins), Power Supplies (C302.1 U300.D4 U300.E4)
~{LED_CS}: Top Nordic (U100.D9), Interfaces (U201.C5)
~{LED_RST}: Top Nordic (U100.H9), Interfaces (U201.F3)
~{PB_IN}: Top Nordic (Q100.1 R104.1 SW100.1), Power Supplies (U300.C4)
HAP_EN: Top Nordic (U100.J8), Interfaces (R200.2 U200.A1)
HAP_TRIG: Top Nordic (U100.J7), Interfaces (U200.B1)
PMIC_INT: Top Nordic (U100.A8), Power Supplies (R306.1 U300.C3)
SCL: Top Nordic (R101.1 TP_SCL.1 U100.J5), Interfaces (U200.C1), Power Supplies (U300.A5)
SCLK: Top Nordic (U100.F9), Interfaces (U201.B3)
SDA: Top Nordic (R102.1 TP_SDA.1 U100.J6), Interfaces (U200.B2), Power Supplies (U300.B5)
SDI: Top Nordic (U100.C9), Interfaces (U201.B4)
SDO: Top Nordic (U100.E9), Interfaces (U201.C4)
USB_UART_RX: Top Nordic (U100.A5), Power Supplies (D304.1 J300.3)
USB_UART_TX: Top Nordic (U100.A6), Power Supplies (D303.1 J300.2)